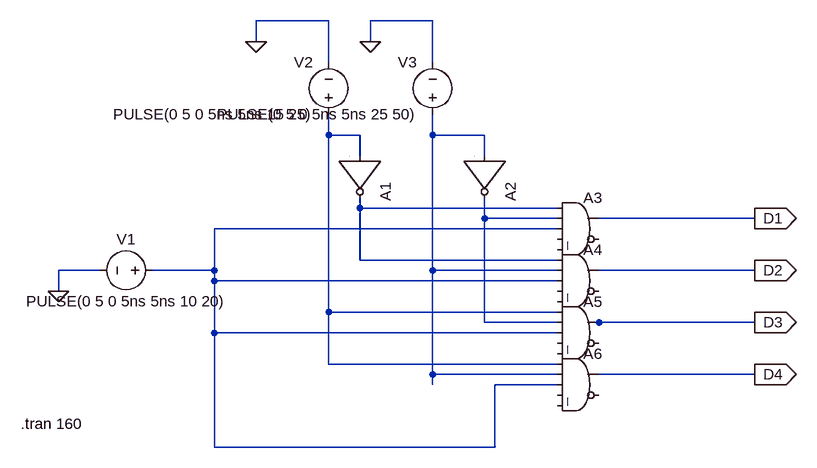
[diagram p0: schematic Demux.asc]
Demux.asc, the LTspice schematic file:
Version 4
SHEET 1 1020 680
WIRE 272 -96 160 -96
WIRE 432 -96 336 -96
WIRE 160 -64 160 -96
WIRE 336 -64 336 -96
WIRE 272 -32 272 -96
WIRE 432 -32 432 -96
WIRE 272 80 272 48
WIRE 320 80 272 80
WIRE 432 80 432 48
WIRE 512 80 432 80
WIRE 320 112 320 80
WIRE 512 112 512 80
WIRE 320 192 320 176
WIRE 624 192 320 192
WIRE 512 208 512 176
WIRE 624 208 512 208
WIRE 928 208 688 208
WIRE 624 224 96 224
WIRE 320 272 320 192
WIRE 624 272 320 272
WIRE -80 288 -144 288
WIRE 96 288 96 224
WIRE 96 288 0 288
WIRE 432 288 432 80
WIRE 624 288 432 288
WIRE 928 288 688 288
WIRE 96 304 96 288
WIRE 624 304 96 304
WIRE -144 320 -144 288
WIRE 272 352 272 80
WIRE 624 352 272 352
WIRE 512 368 512 208
WIRE 624 368 512 368
WIRE 688 368 672 368
WIRE 928 368 688 368
WIRE 96 384 96 304
WIRE 624 384 96 384
WIRE 272 432 272 352
WIRE 624 432 272 432
WIRE 432 448 432 288
WIRE 624 448 432 448
WIRE 928 448 688 448
WIRE 432 464 432 448
WIRE 624 464 528 464
WIRE 96 560 96 384
WIRE 528 560 528 464
WIRE 528 560 96 560
FLAG -144 320 0
FLAG 160 -64 0
FLAG 336 -64 0
FLAG 928 208 D1
IOPIN 928 208 Out
FLAG 928 288 D2
IOPIN 928 288 Out
FLAG 928 368 D3
IOPIN 928 368 Out
FLAG 928 448 D4
IOPIN 928 448 Out
SYMBOL voltage 16 288 R90
WINDOW 0 -32 56 VBottom 2
WINDOW 3 32 56 VTop 2
WINDOW 123 0 0 Left 0
WINDOW 39 0 0 Left 0
SYMATTR InstName V1
SYMATTR Value PULSE(0 5 0 5ns 5ns 10 20)
SYMBOL voltage 272 64 R180
WINDOW 0 24 96 Left 2
WINDOW 3 24 16 Left 2
WINDOW 123 0 0 Left 0
WINDOW 39 0 0 Left 0
SYMATTR InstName V2
SYMATTR Value PULSE(0 5 0 5ns 5ns 15 25)
SYMBOL voltage 432 64 R180
WINDOW 0 24 96 Left 2
WINDOW 3 24 16 Left 2
WINDOW 123 0 0 Left 0
WINDOW 39 0 0 Left 0
SYMATTR InstName V3
SYMATTR Value PULSE(0 5 0 5ns 5ns 25 50)
SYMBOL Digital\\inv 384 112 R90
SYMATTR InstName A1
SYMBOL Digital\\inv 576 112 R90
SYMATTR InstName A2
SYMBOL Digital\\and 656 160 R0
SYMATTR InstName A3
SYMBOL Digital\\and 656 240 R0
SYMATTR InstName A4
SYMBOL Digital\\and 656 320 R0
SYMATTR InstName A5
SYMBOL Digital\\and 656 400 R0
SYMATTR InstName A6
TEXT -202 524 Left 2 !.tran 160

The netlist it stands for:
* Demux.asc
V1 N005 0 PULSE(0 5 0 5ns 5ns 10 20)
V2 N001 0 PULSE(0 5 0 5ns 5ns 15 25)
V3 N002 0 PULSE(0 5 0 5ns 5ns 25 50)
A1 N001 0 0 0 0 N003 0 0 BUF
A2 N002 0 0 0 0 N004 0 0 BUF
A3 N003 N004 N005 0 0 0 D1 0 AND
A4 N003 N002 N005 0 0 0 D2 0 AND
A5 N001 N004 N005 0 0 0 D3 0 AND
A6 N001 N002 N005 0 0 0 D4 0 AND
.tran 160
.backanno
.end